# EasyEDA schematic 1-Schematic_TL074.json
TITLE: TL074; REV: 1.0; Date: 2022-04-28; Sheet: 1/1; Drawn By: BH2VGM; Company: NEU-ISE
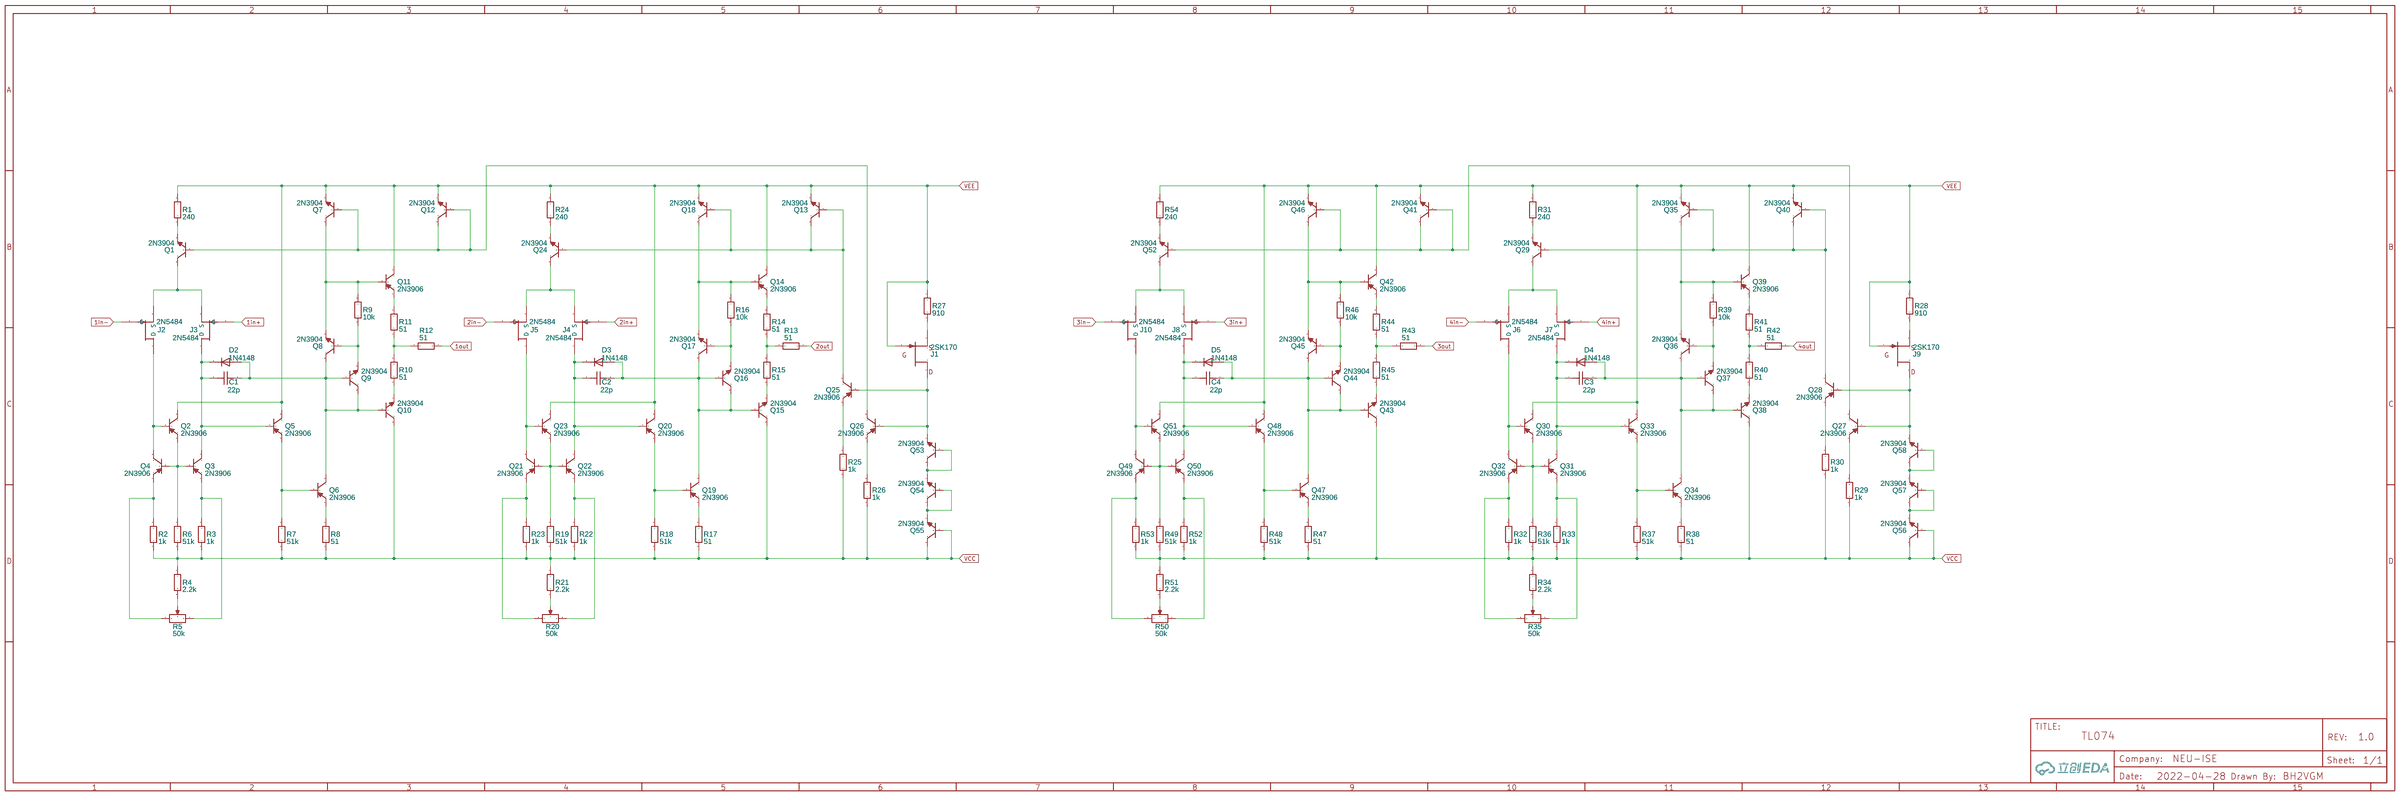
[diagram p0: schematic sheet]

## Parts
C1  22p  [C0805]
C2  22p  [C0805]
C3  22p  [C0805]
C4  22p  [C0805]
D2  1N4148  [DO-35 1N4148]
D3  1N4148  [DO-35 1N4148]
D4  1N4148  [DO-35 1N4148]
D5  1N4148  [DO-35 1N4148]
J1  2SK170  [2SK170]
J2  2N5484  [TO92-2N5484]
J3  2N5484  [TO92-2N5484]
J4  2N5484  [TO92-2N5484]
J5  2N5484  [TO92-2N5484]
J6  2N5484  [TO92-2N5484]
J7  2N5484  [TO92-2N5484]
J8  2N5484  [TO92-2N5484]
J9  2SK170  [2SK170]
J10  2N5484  [TO92-2N5484]
Q1  2N3904  [TO-92-3_L5.1-W4.1-P1.27-L]
Q2  2N3906  [TO-92-3_L5.1-W4.1-P1.27-L]
Q3  2N3906  [TO-92-3_L5.1-W4.1-P1.27-L]
Q4  2N3906  [TO-92-3_L5.1-W4.1-P1.27-L]
Q5  2N3906  [TO-92-3_L5.1-W4.1-P1.27-L]
Q6  2N3906  [TO-92-3_L5.1-W4.1-P1.27-L]
Q7  2N3904  [TO-92-3_L5.1-W4.1-P1.27-L]
Q8  2N3904  [TO-92-3_L5.1-W4.1-P1.27-L]
Q9  2N3904  [TO-92-3_L5.1-W4.1-P1.27-L]
Q10  2N3904  [TO-92-3_L5.1-W4.1-P1.27-L]
Q11  2N3906  [TO-92-3_L5.1-W4.1-P1.27-L]
Q12  2N3904  [TO-92-3_L5.1-W4.1-P1.27-L]
Q13  2N3904  [TO-92-3_L5.1-W4.1-P1.27-L]
Q14  2N3906  [TO-92-3_L5.1-W4.1-P1.27-L]
Q15  2N3904  [TO-92-3_L5.1-W4.1-P1.27-L]
Q16  2N3904  [TO-92-3_L5.1-W4.1-P1.27-L]
Q17  2N3904  [TO-92-3_L5.1-W4.1-P1.27-L]
Q18  2N3904  [TO-92-3_L5.1-W4.1-P1.27-L]
Q19  2N3906  [TO-92-3_L5.1-W4.1-P1.27-L]
Q20  2N3906  [TO-92-3_L5.1-W4.1-P1.27-L]
Q21  2N3906  [TO-92-3_L5.1-W4.1-P1.27-L]
Q22  2N3906  [TO-92-3_L5.1-W4.1-P1.27-L]
Q23  2N3906  [TO-92-3_L5.1-W4.1-P1.27-L]
Q24  2N3904  [TO-92-3_L5.1-W4.1-P1.27-L]
Q25  2N3906  [TO-92-3_L5.1-W4.1-P1.27-L]
Q26  2N3906  [TO-92-3_L5.1-W4.1-P1.27-L]
Q27  2N3906  [TO-92-3_L5.1-W4.1-P1.27-L]
Q28  2N3906  [TO-92-3_L5.1-W4.1-P1.27-L]
Q29  2N3904  [TO-92-3_L5.1-W4.1-P1.27-L]
Q30  2N3906  [TO-92-3_L5.1-W4.1-P1.27-L]
Q31  2N3906  [TO-92-3_L5.1-W4.1-P1.27-L]
Q32  2N3906  [TO-92-3_L5.1-W4.1-P1.27-L]
Q33  2N3906  [TO-92-3_L5.1-W4.1-P1.27-L]
Q34  2N3906  [TO-92-3_L5.1-W4.1-P1.27-L]
Q35  2N3904  [TO-92-3_L5.1-W4.1-P1.27-L]
Q36  2N3904  [TO-92-3_L5.1-W4.1-P1.27-L]
Q37  2N3904  [TO-92-3_L5.1-W4.1-P1.27-L]
Q38  2N3904  [TO-92-3_L5.1-W4.1-P1.27-L]
Q39  2N3906  [TO-92-3_L5.1-W4.1-P1.27-L]
Q40  2N3904  [TO-92-3_L5.1-W4.1-P1.27-L]
Q41  2N3904  [TO-92-3_L5.1-W4.1-P1.27-L]
Q42  2N3906  [TO-92-3_L5.1-W4.1-P1.27-L]
Q43  2N3904  [TO-92-3_L5.1-W4.1-P1.27-L]
Q44  2N3904  [TO-92-3_L5.1-W4.1-P1.27-L]
Q45  2N3904  [TO-92-3_L5.1-W4.1-P1.27-L]
Q46  2N3904  [TO-92-3_L5.1-W4.1-P1.27-L]
Q47  2N3906  [TO-92-3_L5.1-W4.1-P1.27-L]
Q48  2N3906  [TO-92-3_L5.1-W4.1-P1.27-L]
Q49  2N3906  [TO-92-3_L5.1-W4.1-P1.27-L]
Q50  2N3906  [TO-92-3_L5.1-W4.1-P1.27-L]
Q51  2N3906  [TO-92-3_L5.1-W4.1-P1.27-L]
Q52  2N3904  [TO-92-3_L5.1-W4.1-P1.27-L]
Q53  2N3904  [TO-92-3_L5.1-W4.1-P1.27-L]
Q54  2N3904  [TO-92-3_L5.1-W4.1-P1.27-L]
Q55  2N3904  [TO-92-3_L5.1-W4.1-P1.27-L]
Q56  2N3904  [TO-92-3_L5.1-W4.1-P1.27-L]
Q57  2N3904  [TO-92-3_L5.1-W4.1-P1.27-L]
Q58  2N3904  [TO-92-3_L5.1-W4.1-P1.27-L]
R1  240  [R0805]
R2  1k  [R0805]
R3  1k  [R0805]
R4  2.2k  [R0805]
R5  50k  [3296W 10ROUND]
R6  51k  [R0805]
R7  51k  [R0805]
R8  51  [R0805]
R9  10k  [R0805]
R10  51  [R0805]
R11  51  [R0805]
R12  51  [R0805]
R13  51  [R0805]
R14  51  [R0805]
R15  51  [R0805]
R16  10k  [R0805]
R17  51  [R0805]
R18  51k  [R0805]
R19  51k  [R0805]
R20  50k  [3296W 10ROUND]
R21  2.2k  [R0805]
R22  1k  [R0805]
R23  1k  [R0805]
R24  240  [R0805]
R25  1k  [R0805]
R26  1k  [R0805]
R27  910  [R0805]
R28  910  [R0805]
R29  1k  [R0805]
R30  1k  [R0805]
R31  240  [R0805]
R32  1k  [R0805]
R33  1k  [R0805]
R34  2.2k  [R0805]
R35  50k  [3296W 10ROUND]
R36  51k  [R0805]
R37  51k  [R0805]
R38  51  [R0805]
R39  10k  [R0805]
R40  51  [R0805]
R41  51  [R0805]
R42  51  [R0805]
R43  51  [R0805]
R44  51  [R0805]
R45  51  [R0805]
R46  10k  [R0805]
R47  51  [R0805]
R48  51k  [R0805]
R49  51k  [R0805]
R50  50k  [3296W 10ROUND]
R51  2.2k  [R0805]
R52  1k  [R0805]
R53  1k  [R0805]
R54  240  [R0805]

## Library data of the parts
C1-C4 = C0805X7R103J500NT: Supplier: LCSC; Supplier Part: C2835540; Manufacturer: SANYEAR(叁叶源); JLCPCB Part Class: Extended Part; Contributor: LCSC
D2-D5 = 1N4148 DO-35: Contributor: king13478509115
J1 J9 = 2SK170: Contributor: king13478509115
J2-J8 J10 = 2N5484: Contributor: king13478509115
Q1 Q7-Q10 Q12 Q13 Q15-Q18 Q24 Q29 Q35-Q38 Q40 Q41 Q43-Q46 Q52-Q58 = 2N3904: Supplier: LCSC; Manufacturer: SEMTECH; Supplier Part: C118538; JLCPCB Part Class: Extended Part
Q2-Q6 Q11 Q14 Q19-Q23 Q25-Q28 Q30-Q34 Q39 Q42 Q47-Q51 = 2N3906_C118539: Supplier: LCSC; Manufacturer: SEMTECH; Supplier Part: C118539; JLCPCB Part Class: Extended Part
R1-R4 R6-R19 R21-R34 R36-R49 R51-R54 = 0805: Supplier: LCSC; Supplier Part: C9900012715; Manufacturer: null; link: https://atta.szlcsc.comnull; Contributor: LCSC; JLCPCB Part Class: Extended Part
R5 R20 R35 R50 = 3296W: Supplier: LCSC; Manufacturer: BOURNS; Manufacturer Part: 3296W-1-103LF; Supplier Part: C34846; Resistance(Ohms): 10K; Resistance (Ohms): 10K; JLCPCB Part Class: Extended Part; Contributor: king13478509115

## Nets
VCC: Q10.3(C) Q15.3(C) Q38.3(C) Q43.3(C) Q55.2(B) Q55.3(C) Q56.2(B) Q56.3(C) R2.1 R3.1 R4.1 R6.1 R7.1 R8.1 R17.1 R18.1 R19.1 R21.1 R22.1 R23.1 R25.1 R26.1 R29.1 R30.1 R32.1 R33.1 R34.1 R36.1 R37.1 R38.1 R47.1 R48.1 R49.1 R51.1 R52.1 R53.1
VEE: J1.2(G) J9.2(G) Q2.3 Q5.3 Q7.1(E) Q11.3 Q12.1(E) Q13.1(E) Q14.3 Q18.1(E) Q20.3 Q23.3 Q30.3 Q33.3 Q35.1(E) Q39.3 Q40.1(E) Q41.1(E) Q42.3 Q46.1(E) Q48.3 Q51.3 R1.2 R24.2 R27.1 R28.1 R31.2 R54.2
1in+: J3.3(G)
1in-: J2.3(G)
1out: R12.1
2in+: J4.3(G)
2in-: J5.3(G)
2out: R13.1
3in+: J8.3(G)
3in-: J10.3(G)
3out: R43.1
4in+: J7.3(G)
4in-: J6.3(G)
4out: R42.1
Net-(C1-1): C1.1 D2.2 J3.1(D) Q3.3 Q5.2
Net-(C1-2): C1.2 D2.1 Q6.3 Q8.3(C) Q9.2(B) Q9.3(C) Q10.2(B)
Net-(C2-1): C2.1 D3.2 J4.1(D) Q20.2 Q22.3
Net-(C2-2): C2.2 D3.1 Q15.2(B) Q16.2(B) Q16.3(C) Q17.3(C) Q19.3
Net-(C3-1): C3.1 D4.2 J7.1(D) Q31.3 Q33.2
Net-(C3-2): C3.2 D4.1 Q34.3 Q36.3(C) Q37.2(B) Q37.3(C) Q38.2(B)
Net-(C4-1): C4.1 D5.2 J8.1(D) Q48.2 Q50.3
Net-(C4-2): C4.2 D5.1 Q43.2(B) Q44.2(B) Q44.3(C) Q45.3(C) Q47.3
Net-(J1-1): J1.1(S) R27.2
Net-(J1-3): J1.3(D) Q25.2 Q26.2 Q53.1(E)
Net-(J2-1): J2.1(D) Q2.2 Q4.3
Net-(J2-2): J2.2(S) J3.2(S) Q1.3(C)
Net-(J4-2): J4.2(S) J5.2(S) Q24.3(C)
Net-(J5-1): J5.1(D) Q21.3 Q23.2
Net-(J6-1): J6.1(D) Q30.2 Q32.3
Net-(J6-2): J6.2(S) J7.2(S) Q29.3(C)
Net-(J8-2): J8.2(S) J10.2(S) Q52.3(C)
Net-(J9-1): J9.1(S) R28.2
Net-(J9-3): J9.3(D) Q27.2 Q28.2 Q58.1(E)
Net-(J10-1): J10.1(D) Q49.3 Q51.2
Net-(Q1-1): Q1.1(E) R1.1
Net-(Q1-2): Q1.2(B) Q7.2(B) Q12.2(B) Q12.3(C) Q26.3
Net-(Q2-1): Q2.1 Q3.2 Q4.2 R6.2
Net-(Q3-1): Q3.1 R3.2 R5.1
Net-(Q4-1): Q4.1 R2.2 R5.3
Net-(Q5-1): Q5.1 Q6.2 R7.2
Net-(Q6-1): Q6.1 R8.2
Net-(Q7-3): Q7.3(C) Q8.1(E) Q11.2 R9.2
Net-(Q8-2): Q8.2(B) Q9.1(E) R9.1
Net-(Q10-1): Q10.1(E) R10.1
Net-(Q11-1): Q11.1 R11.2
Net-(Q13-2): Q13.2(B) Q13.3(C) Q18.2(B) Q24.2(B) Q25.3
Net-(Q14-1): Q14.1 R14.2
Net-(Q14-2): Q14.2 Q17.1(E) Q18.3(C) R16.2
Net-(Q15-1): Q15.1(E) R15.1
Net-(Q16-1): Q16.1(E) Q17.2(B) R16.1
Net-(Q19-1): Q19.1 R17.2
Net-(Q19-2): Q19.2 Q20.1 R18.2
Net-(Q21-1): Q21.1 R20.3 R23.2
Net-(Q21-2): Q21.2 Q22.2 Q23.1 R19.2
Net-(Q22-1): Q22.1 R20.1 R22.2
Net-(Q24-1): Q24.1(E) R24.1
Net-(Q25-1): Q25.1 R25.2
Net-(Q26-1): Q26.1 R26.2
Net-(Q27-1): Q27.1 R29.2
Net-(Q27-3): Q27.3 Q41.2(B) Q41.3(C) Q46.2(B) Q52.2(B)
Net-(Q28-1): Q28.1 R30.2
Net-(Q28-3): Q28.3 Q29.2(B) Q35.2(B) Q40.2(B) Q40.3(C)
Net-(Q29-1): Q29.1(E) R31.1
Net-(Q30-1): Q30.1 Q31.2 Q32.2 R36.2
Net-(Q31-1): Q31.1 R33.2 R35.1
Net-(Q32-1): Q32.1 R32.2 R35.3
Net-(Q33-1): Q33.1 Q34.2 R37.2
Net-(Q34-1): Q34.1 R38.2
Net-(Q35-3): Q35.3(C) Q36.1(E) Q39.2 R39.2
Net-(Q36-2): Q36.2(B) Q37.1(E) R39.1
Net-(Q38-1): Q38.1(E) R40.1
Net-(Q39-1): Q39.1 R41.2
Net-(Q42-1): Q42.1 R44.2
Net-(Q42-2): Q42.2 Q45.1(E) Q46.3(C) R46.2
Net-(Q43-1): Q43.1(E) R45.1
Net-(Q44-1): Q44.1(E) Q45.2(B) R46.1
Net-(Q47-1): Q47.1 R47.2
Net-(Q47-2): Q47.2 Q48.1 R48.2
Net-(Q49-1): Q49.1 R50.3 R53.2
Net-(Q49-2): Q49.2 Q50.2 Q51.1 R49.2
Net-(Q50-1): Q50.1 R50.1 R52.2
Net-(Q52-1): Q52.1(E) R54.1
Net-(Q53-2): Q53.2(B) Q53.3(C) Q54.1(E)
Net-(Q54-2): Q54.2(B) Q54.3(C) Q55.1(E)
Net-(Q56-1): Q56.1(E) Q57.2(B) Q57.3(C)
Net-(Q57-1): Q57.1(E) Q58.2(B) Q58.3(C)
Net-(R4-2): R4.2 R5.2
Net-(R10-2): R10.2 R11.1 R12.2
Net-(R13-2): R13.2 R14.1 R15.2
Net-(R20-2): R20.2 R21.2
Net-(R34-2): R34.2 R35.2
Net-(R40-2): R40.2 R41.1 R42.2
Net-(R43-2): R43.2 R44.1 R45.2
Net-(R50-2): R50.2 R51.2
